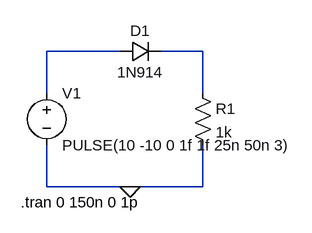
[diagram p0: schematic diodo_lentito.asc]
diodo_lentito.asc, the LTspice schematic file:
Version 4
SHEET 1 880 680
WIRE 192 64 80 64
WIRE 320 64 256 64
WIRE 80 128 80 64
WIRE 320 128 320 64
WIRE 80 272 80 208
WIRE 208 272 80 272
WIRE 320 272 320 208
WIRE 320 272 208 272
FLAG 208 272 0
SYMBOL voltage 80 112 R0
WINDOW 123 0 0 Left 0
WINDOW 39 0 0 Left 0
SYMATTR InstName V1
SYMATTR Value PULSE(10 -10 0 1f 1f 25n 50n 3)
SYMBOL res 304 112 R0
SYMATTR InstName R1
SYMATTR Value 1k
SYMBOL diode 192 80 R270
WINDOW 0 32 32 VTop 2
WINDOW 3 0 32 VBottom 2
SYMATTR InstName D1
SYMATTR Value 1N914
TEXT 40 296 Left 2 !.tran 0 150n 0 1p

The netlist it stands for:
* diodo_lentito.asc
V1 N001 0 PULSE(10 -10 0 1f 1f 25n 50n 3)
R1 N002 0 1k
D1 N001 N002 1N914
.model D D
.lib standard.dio
.tran 0 150n 0 1p
.backanno
.end